# EAGLE design DMC_Tracer (EAGLE 7.6.0)
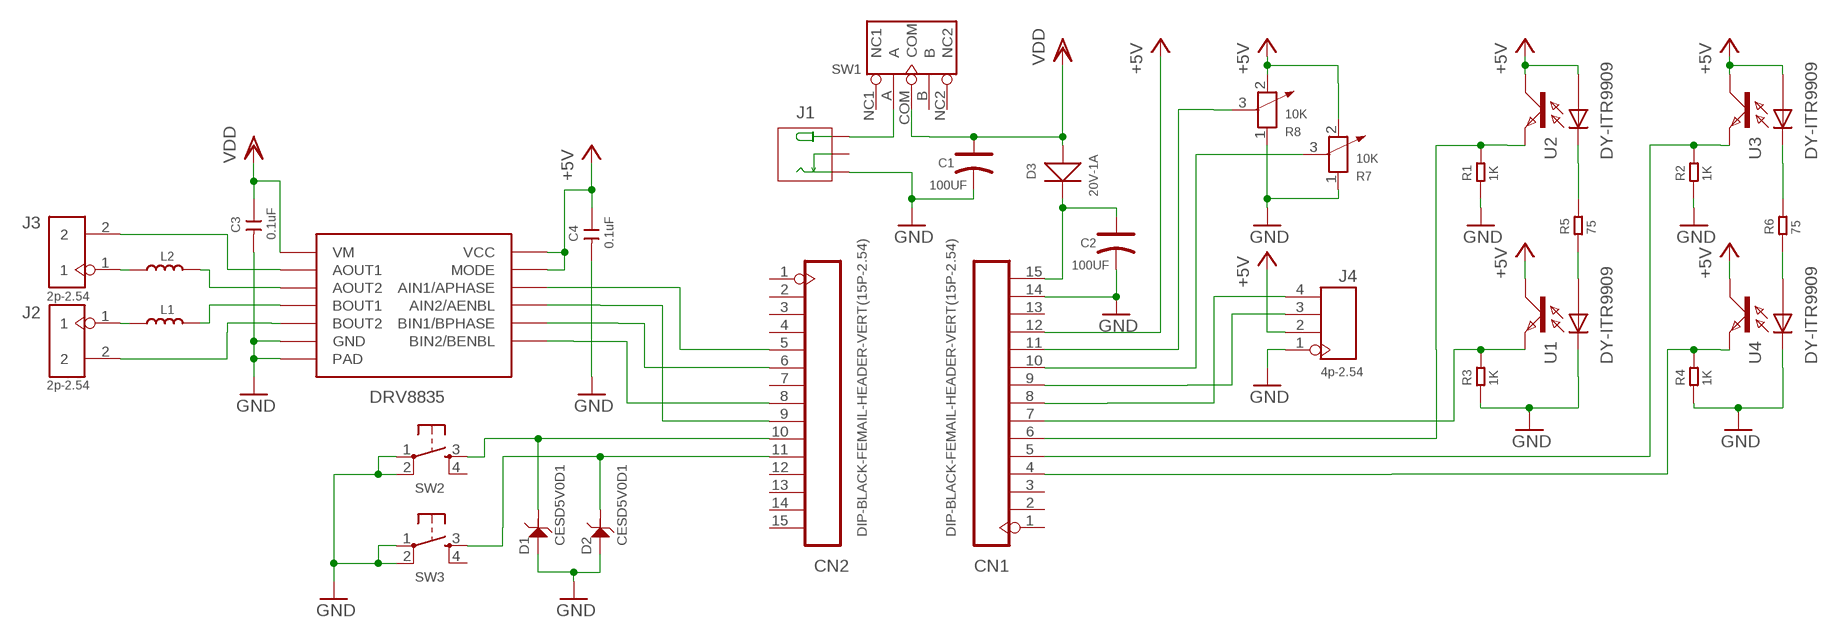
[diagram p0: schematic, sheet 1]

## Parts
C1  100UF  ALUMINUM-SMD-47UF-25V(D6.3-H5.3MM)  [ELECTRO-SMD-C-6MM]
C2  100UF  ALUMINUM-SMD-47UF-25V(D6.3-H5.3MM)  [ELECTRO-SMD-C-6MM]
C3  0.1uF  CERAMIC-100NF-50V-10%-X7R(0603)  [C0603]
C4  0.1uF  CERAMIC-100NF-50V-10%-X7R(0603)  [C0603]
CN1  DIP-BLACK-FEMAIL-HEADER-VERT(15P-2.54)  [H15-2.54]
CN2  DIP-BLACK-FEMAIL-HEADER-VERT(15P-2.54)  [H15-2.54]
D1  CESD5V0D1  SMD-DIODE-ESD-6.2V-250MW(SOD-123)  [SOD-123]
D2  CESD5V0D1  SMD-DIODE-ESD-6.2V-250MW(SOD-123)  [SOD-123]
D3  20V-1A  SMD-DIODE-SCHOTTKY-20V-1A(SOD-123)  [SOD-123]
J1  DC-005  JACK-DC-005'DC-005'  [3P-L14.2*W11.0*H9.0MM]
J2  2p-2.54  DIP-BLACK-MALE-HEADER-VERT(2P-2.54)  [H2-2.54]
J3  2p-2.54  DIP-BLACK-MALE-HEADER-VERT(2P-2.54)  [H2-2.54]
J4  4p-2.54  DIP-BLACK-FEMALE-HEADER-VERT(4P-2.54)  [H4-2.54]
L1  SMD-INDUCTOR(2P-8X8MM)  [L8040]
L2  SMD-INDUCTOR(2P-8X8MM)  [L8040]
R1  1K  SMD-RES-1K-5%-1/8W(0805)  [R0805]
R2  1K  SMD-RES-1K-5%-1/8W(0805)  [R0805]
R3  1K  SMD-RES-1K-5%-1/8W(0805)  [R0805]
R4  1K  SMD-RES-1K-5%-1/8W(0805)  [R0805]
R5  75  SMD-RES-75R-1%-1/8W(0805)  [R0805]
R6  75  SMD-RES-75R-1%-1/8W(0805)  [R0805]
R7  10K  DIP-VR-TOP-ADJ-1K-3362P(3P-7.0X7.0X5.0MM)  [ADJR3-7.0X7.0X5.0MM]
R8  10K  DIP-VR-TOP-ADJ-1K-3362P(3P-7.0X7.0X5.0MM)  [ADJR3-7.0X7.0X5.0MM]
SW1  DIP-TOGGLE-SWITCH-ON-ON(3+2P-8.8X4.6MM)-90D  [SW5-2.0-8.8X4.4X4.7MM-90D]
SW2  T-SWITCH-10-SEEED  [B3F-10XX-SEEED]
SW3  T-SWITCH-10-SEEED  [B3F-10XX-SEEED]
U1  DY-ITR9909  [DY-ITR9909]
U2  DY-ITR9909  [DY-ITR9909]
U3  DY-ITR9909  [DY-ITR9909]
U4  DY-ITR9909  [DY-ITR9909]
U$1  DRV8835  [WSON12]

## Nets
+5V: C4.1 CN1.12 J4.2 R7.2 R8.2 U1.C U2.A U2.C U3.A U3.C U4.C U$1.P$11(MODE) U$1.P$12(VCC)
AOUT1: L2.2 U$1.P$3(AOUT2)
AOUT2: J3.2 U$1.P$2(AOUT1)
BOUT1: J2.2 U$1.P$5(BOUT2)
BOUT2: L1.2 U$1.P$4(BOUT1)
GND: C1.- C2.- C3.2 C4.2 CN1.14 D1.+ D2.+ J1.-1(-) J4.1 R1.1 R2.1 R3.1 R4.1 R7.1 R8.1 SW2.1(P) SW2.2(P1) SW3.1(P) SW3.2(P1) U1.K U4.K U$1.P$6(GND) U$1.P$13(PAD) U$1.P$14(GND)
N$1: CN1.8 J4.4
N$2: CN1.9 J4.3
N$3: CN2.10 D1.- SW2.3(S)
N$4: CN2.11 D2.- SW3.3(S)
N$5: CN1.10 R7.3
N$6: CN1.6 R1.2 U2.E
N$7: CN1.5 R2.2 U3.E
N$8: CN1.4 R4.2 U4.E
N$9: R5.2 U2.K
N$10: J1.+ SW1.A
N$11: CN2.5 U$1.P$10(AIN1/APHASE)
N$12: R6.2 U3.K
N$13: J3.1 L2.1
N$14: R6.1 U4.A
N$15: R5.1 U1.A
N$16: CN2.6 U$1.P$8(BIN1/BPHASE)
N$17: CN2.9 U$1.P$9(AIN2/AENBL)
N$18: CN2.8 U$1.P$7(BIN2/BENBL)
N$19: J2.1 L1.1
N$21: C2.+ CN1.15 D3.-
N$24: CN1.11 R8.3
N$25: CN1.7 R3.2 U1.E
VDD: C1.+ C3.1 D3.+ SW1.COM U$1.P$1(VM)
Unconnected: CN1.1 CN1.2 CN1.3 CN1.13 CN2.1 CN2.2 CN2.3 CN2.4 CN2.7 CN2.12 CN2.13 CN2.14 CN2.15 J1.-2(CDN) SW1.B SW1.NC1 SW1.NC2 SW2.4(S1) SW3.4(S1)

## Library data of the parts
C1 C2 = OPL_Capacitor:ALUMINUM-SMD-47UF-25V(D6.3-H5.3MM): 302030059; MPN: CS1E470M-CRE54; VALUE: 47UF
C3 C4 = OPL_Capacitor:CERAMIC-100NF-50V-10%-X7R(0603): 302010138; MPN: CC0603KRX7R9BB104; VALUE: 100nf
CN1 CN2 = OPL_Connector:DIP-BLACK-FEMAIL-HEADER-VERT(15P-2.54)
D1 D2 = OPL_Circuit_Protection:SMD-DIODE-ESD-6.2V-250MW(SOD-123): 304060001; MPN: CESD5V0D1
D3 = OPL_Discrete_Semiconductor:SMD-DIODE-SCHOTTKY-20V-1A(SOD-123): 304020034; MPN: B5819W
J1 = OPL_Connector:JACK-DC-005: 320120003
J2 J3 = OPL_Connector:DIP-BLACK-MALE-HEADER-VERT(2P-2.54): 320020016; MPN: P125-1102A0BS116A1
J4 = OPL_Connector:DIP-BLACK-FEMALE-HEADER-VERT(4P-2.54): 320030017; MPN: F185-1104A1BSYA1
L1 L2 = OPL_Inductor:SMD-INDUCTOR(2P-8X8MM)
R1-R4 = OPL_Resistor:SMD-RES-1K-5%-1/8W(0805): 301012189; MPN: RC0805JR-071KL
R5 R6 = OPL_Resistor:SMD-RES-75R-1%-1/8W(0805): 301012181; MPN: RC0805JR-071KL; VALUE: 1K
R7 R8 = OPL_Resistor:DIP-VR-TOP-ADJ-1K-3362P(3P-7.0X7.0X5.0MM): 301040014; MPN: SX3362P; VALUE: 1K
SW1 = OPL_Switch:DIP-TOGGLE-SWITCH-ON-ON(3+2P-8.8X4.6MM)-90D: 311030008; MPN: 3P-2.0-90D3P-2.0-90D-REINFORCE
SW2 SW3 = sw2:T-SWITCH: TACTILE SWITCH
U1-U4 = Photo_Interrupter:DY-ITR9909
U$1 = Motor_Driver2:DRV8835

## Board
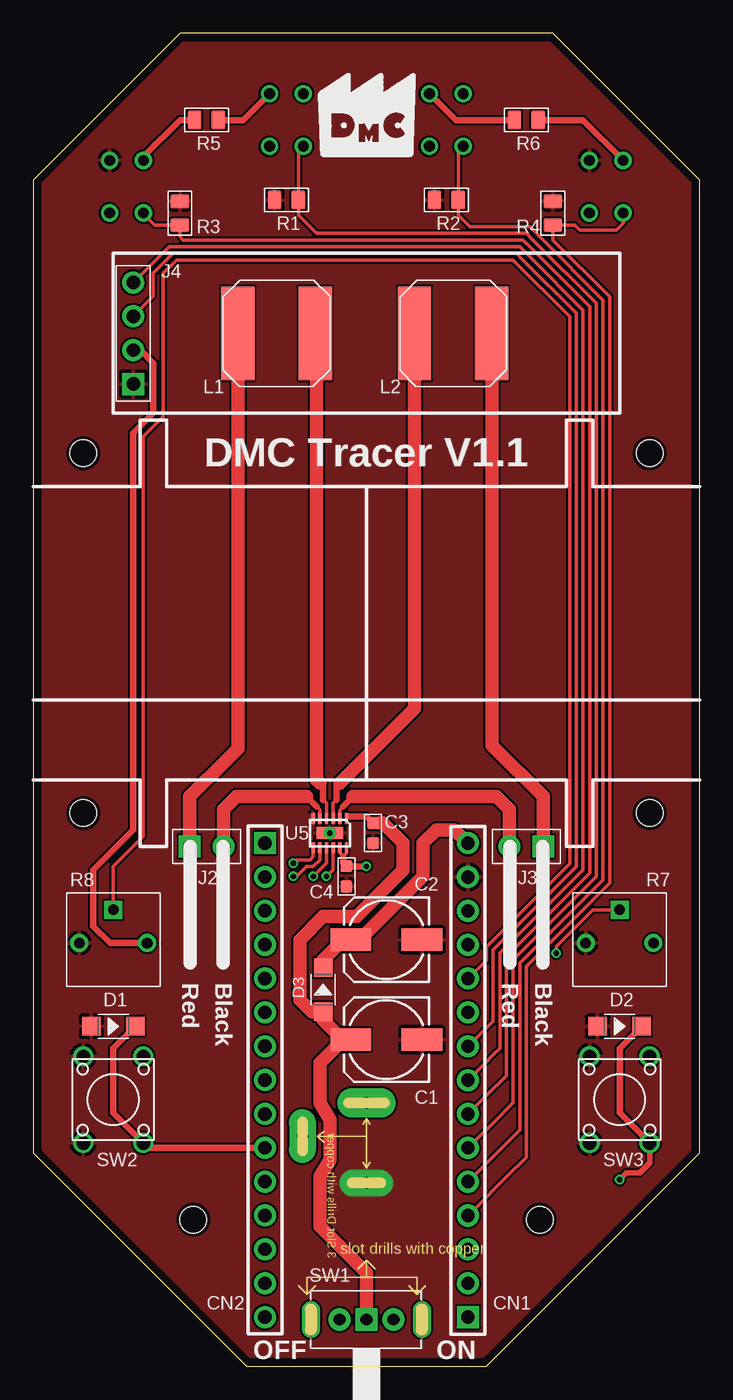
[diagram p1: board, top side]
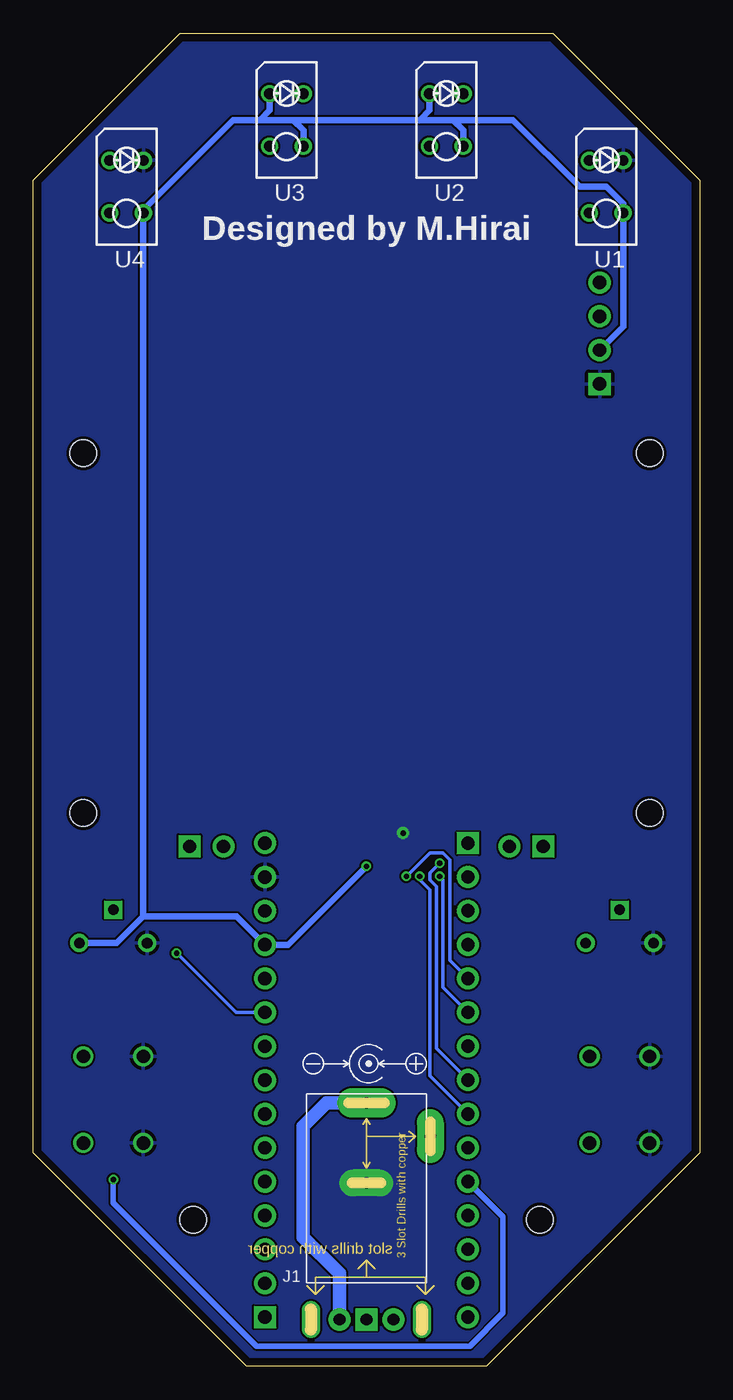
[diagram p2: board, bottom side, seen from below]

Size 50 x 100 mm. Coordinates in mm from the lower left corner, seen from the top.
Outline: 0,16 16,0 34,0 50,16 50,89 39,100 11,100 0,89 0,16
Copper layers (1*16): Top 0.035mm / dielectric 1.5mm / Bottom 0.035mm
Design rules "SeeedStudio_2layer_DRU_no_angle_20140221": minimum track width 6mil, minimum drill 12mil, track to track 6mil, track to pad 6mil, pad to pad 6mil, via to via 6mil, smd to smd 0mil, copper to edge 10mil, drill to drill 10mil, minimum pad ring 10mil, minimum via ring 6mil, stop-mask expansion 2mil, vias tented up to drill 100mil, thermal gap 10mil
Holes 2 mm at 3.75,68.5 3.75,41.5 46.25,41.5 46.25,68.5 12,11 38,11

### Footprints (pad centres in the part's own frame; a part is rotated, then mirrored left to right if it is on the bottom)
ELECTRO-SMD-C-6MM = smd 3.048 x 1.651: + 2.667,0; - -2.667,0
C0603 = smd 0.889 x 0.889: 1 0,0.762; 2 0,-0.762
H15-2.54 = drill 1 pad 1.651 square: 1 1.27,-20.32 | drill 1 pad 1.651: 2 1.27,-17.78; 3 1.27,-15.24; 4 1.27,-12.7; 5 1.27,-10.16; 6 1.27,-7.62; 7 1.27,-5.08; 8 1.27,-2.54; 9 1.27,0; 10 1.27,2.54; 11 1.27,5.08; 12 1.27,7.62; 13 1.27,10.16; 14 1.27,12.7; 15 1.27,15.24
SOD-123 = smd 1.397 x 1.397: + -1.651,0; - 1.651,0
3P-L14.2*W11.0*H9.0MM = drill 0.813 pad 2.2 long: + 13.5,0 | drill 0.813 pad 2.032 long: -1 7.5,0; -2 11,-4.8
H2-2.54 = drill 1 pad 1.651 square: 1 0,1.27 | drill 1 pad 1.651: 2 0,-1.27
H4-2.54 = drill 1 pad 1.651 square: 1 0,3.81 | drill 1 pad 1.651: 2 0,1.27; 3 0,-1.27; 4 0,-3.81
L8040 = smd 7 x 2.5: 1 0,2.9; 2 0,-2.9
R0805 = smd 1.397 x 1.016: 1 0,0.889; 2 0,-0.889
ADJR3-7.0X7.0X5.0MM = drill 0.8 pad 1.35: 1 -2.54,-0.25; 2 2.54,-0.25 | drill 0.8 pad 1.35 square: 3 0,2.25
SW5-2.0-8.8X4.4X4.7MM-90D = drill 0.889 pad 1.651: A 0,2.032; B 0,-2.032 | drill 0.889 pad 1.651 square: COM 0,0 | drill 0.762 pad 1.397 long: NC1 0,4.166; NC2 0,-4.166
B3F-10XX-SEEED = drill 1: 1 -3.25,2.25; 2 3.25,2.25; 3 -3.25,-2.25; 4 3.25,-2.25
DY-ITR9909 = drill 0.8: A -1.27,1.97; C 1.27,-1.97; E -1.27,-1.97; K 1.27,1.97
WSON12 = smd 0.8 x 0.25: P$1 -1.1,1.25; P$2 -1.1,0.75; P$3 -1.1,0.25; P$4 -1.1,-0.25; P$5 -1.1,-0.75; P$6 -1.1,-1.25; P$7 1.1,-1.25; P$8 1.1,-0.75; P$9 1.1,-0.25; P$10 1.1,0.25; P$11 1.1,0.75; P$12 1.1,1.25 | smd 0.9 x 2: P$13 0,0 | drill 0.4 pad 0.813: P$14 0,0

### Placement (x,y rotation side)
C1  26.5,24.5 180 top
C2  26.5,32 180 top
C3  25.5,40 0 top
C4  23.5,36.75 0 top
CN1  31.35,24 0 top
CN2  18.65,18.93 180 top
D1  6,25.5 0 top
D2  44,25.5 0 top
D3  21.75,28.25 90 top
J1  25,6.25 90 bottom
J2  13,39 90 top
J3  37,39 270 top
J4  7.5,77.5 180 top
L1  18.25,77.5 90 top
L2  31.5,77.5 270 top
R1  19,87.5 90 top
R2  31,87.5 90 top
R3  11,86.5 0 top
R4  39,86.5 0 top
R5  13,93.5 90 top
R6  37,93.5 270 top
R7  44,32 0 top
R8  6,32 0 top
SW1  25,3.5 270 top
SW2  6,20 90 top
SW3  44,20 90 top
U1  7,88.5 0 bottom
U2  19,93.5 0 bottom
U3  31,93.5 0 bottom
U4  43,88.5 0 bottom
U$1  22.25,40 270 top

### Tracks (layer width: path | path; a pad name or v marks a point on that pad's centre or on a via)
+5V  (via drill 0.4)
  Top 0.25: U$1.P$11 23,38.75 23,38.5 23.25,38.25 23.5,38.5 23.5,38.75 U$1.P$12
  Top 0.5: J4.2 8.04,76.23 9,75.27 9,72 9,71.75 9,71.5 7.5,70 7.5,40.25 6.75,39.5 4.5,37.25 4.5,33 5.75,31.75 R8.2 | v25,37.5 23.51,37.5 C4.1 23.25,37.76 23.25,38.25
  Bottom 0.5: U2.C 17.73,92.23 17.73,92.73 18.5,93.5 | U2.A 20.27,94.77 20.27,94.23 21,93.5 | U3.C 29.73,92.23 29.73,92.73 30.5,93.5 | U3.A 32.27,94.77 32.27,94.23 33,93.5 | U4.C 41.73,86.77 40,88.5 35,93.5 33,93.5 | 33,93.5 30.5,93.5 | 30.5,93.5 21,93.5 | 21,93.5 18.5,93.5 | 18.5,93.5 17.5,93.5 14,93.5 9,88.5 7,88.5 5.73,87.23 U1.C 5.73,79.77 5.73,78 J4.2 | 41.75,33.75 41.25,33.75 34.75,33.75 CN1.12 30.88,31.62 v25,37.5 | U4.C 41.75,86.51 | 41.75,33.75 43.75,31.75 R7.2 | 41.75,33.75 41.75,34.5 41.75,85.76 U4.C
AOUT1
  Top 0.25: U$1.P$3 22.5,42.25 22.75,42.5
  Top 0.5: 22.75,42.5 22.75,43.5 23,43.75
  Top 1: 23,43.75 28.35,49.1 28.6,49.35 L2.2
AOUT2
  Top 0.25: U$1.P$2 23,41.75 23.25,42
  Top 0.5: 23.25,42 24,42.75
  Top 1: J3.2 35.73,41.77 34.75,42.75 24,42.75
BOUT1
  Top 0.25: U$1.P$5 21.5,41.75 21.25,42
  Top 0.5: 21.25,42 20.5,42.75
  Top 1: J2.2 14.27,41.77 15.25,42.75 19.75,42.75 20.5,42.75
BOUT2
  Top 0.25: U$1.P$4 22,42.25 21.75,42.5
  Top 0.5: 21.75,42.5 21.75,43.5 21.5,43.75
  Top 1: L1.2 21.25,77.4 21.25,65.25 21.25,44 21.5,43.75
GND
  pour Bottom: 0.75,16.25 16.25,0.75 33.75,0.75 49.25,16.25 49.25,88.75 38.75,99.25 11.25,99.25 0.75,88.75
  pour Top: 0.75,16.25 16.25,0.75 33.75,0.75 49.25,16.25 49.25,88.75 38.75,99.25 11.25,99.25 0.75,88.75
  pour Top (no thermals): 20.5,41.38 21,41.38 21,40.83 20.5,40.83
  pour Bottom (no thermals): 22,40.75 21.5,40.25 21.5,39.75 22,39.25 22.5,39.25 23,39.75 23,40.25 22.5,40.75
  pour Bottom (no thermals): 23,15 22.5,14.5 22.5,13 23,12.5 27,12.5 27.5,13 27.5,14.5 27,15
  pour Top (no thermals): 23,15 22.5,14.5 22.5,13 23,12.5 27,12.5 27.5,13 27.5,14.5 27,15
N$1
  Top 0.25: J4.4 10.19,84 34.75,84 36.5,84 37,83.5 37.25,83.25 41.25,79.25 41.25,74.5 41.25,42 41.25,38.5 41.25,37.25 37.75,33.75 35,31 35,23.84 34.5,23.34 34,22.84 CN1.8
N$2
  Top 0.25: J4.3 9,80.27 9,82 10.5,83.5 12.23,83.5 36.25,83.5 36.75,83 40.75,79 40.75,74.25 40.75,42 40.75,39 40.75,37.5 37.25,34 35,31.75 34.5,31.25 34.5,29 34.5,25.88 34,25.38 CN1.9
N$3
  Top 0.5: D1.- 6,23.85 6,22.25 6,19 SW2.3 8.62,16.39 CN2.10
N$4  (via drill 0.4)
  Top 0.4: SW3.3 46.25,15.25 45.5,14.5
  Top 0.406: v44,14 44.5,14.5 45.5,14.5
  Top 0.5: D2.- 44,23.85 44,21.75 44,19 SW3.3
  Bottom 0.4: CN2.11 14.75,11.21 14.75,4 17.25,1.5 20,1.5 32.5,1.5 33.25,1.5 35.25,3.5 44,12.25 44,13
  Bottom 0.406: 44,13 v44,14
N$5  (via drill 0.4)
  Top 0.25: R7.3 42,34.25 39.25,31.5 v39.25,31
  Bottom 0.25: CN1.10 34.79,26.54 v39.25,31
N$6
  Top 0.25: R1.2 19.89,87.11 R1.2 | R1.2 19.89,91.15 U2.E | R1.2 19.89,86.36 20,86.25 21.25,85 37,85 37.5,84.5 42.25,79.75 42.25,75 42.25,42 42.25,37.5 42.25,36.75 38.75,33.25 36,30.5 36,19.76 35.5,19.26 35,18.76 CN1.6
N$7
  Top 0.25: 32,87.5 R2.2 | 31.89,87 R2.2 | R2.2 31.89,91.15 U3.E | R2.2 31.89,86.5 31.89,86.36 32.75,85.5 32.89,85.5 37.25,85.5 37.75,85 38,84.75 42.75,80 42.75,75.25 42.75,42 42.75,39 42.75,36.75 42.75,36.5 39.62,33.38 | 39.25,33 39.62,33.38 | CN1.5 35.5,16.72 36,17.22 36.5,17.72 36.5,30.25 39.62,33.38
N$8
  Top 0.25: R4.2 39.14,85.61 | R4.2 39,84.5 43.25,80.25 43.25,75.5 43.25,42 43.25,38.5 43.25,36.25 39.75,32.75 37,30 37,15.68 36.5,15.18 36,14.68 CN1.4 | U4.E 44.27,85.77 44,85.5 43.75,85.25 41,85.25 40.75,85.5 40.64,85.61 R4.2
N$9
  Top 0.5: U2.K 15.76,93.5 R5.2
N$10
  Bottom 1: SW1.A 27.03,6.97 29.75,9.69 29.75,18 28.07,19.68 28,19.75 J1.+
N$11  (via drill 0.4)
  Top 0.25: U$1.P$10 22.5,37.75 22.5,37.25 v22,36.75
  Bottom 0.25: v22,36.75 20.25,38.5 19.25,38.5 18.75,38 18.75,37.5 18.75,31.45 18.75,30.45 CN2.5
N$12
  Top 0.5: R6.2 34.5,93.5 31.7,93.5 U3.K
N$13
  Top 1: J3.1 38.27,42.73 34.5,46.5 34.4,46.6 L2.1
N$14
  Top 0.5: U4.A 41.24,93.5 R6.1
N$15
  Top 0.5: U1.A 8.27,90.77 11,93.5 R5.1
N$16  (via drill 0.4)
  Top 0.25: U$1.P$8 21.5,38.25 21.5,38 21,37.5 20.5,37.5 20.25,37.25 19.75,36.75 v19.5,36.75
  Bottom 0.25: v19.5,36.75 19.25,36.5 19.25,29.41 19.25,28.41 CN2.6
N$17  (via drill 0.4)
  Top 0.25: U$1.P$9 22,38 22,37.75 v21,36.75
  Bottom 0.25: v21,36.75 21,36.5 20.75,36.25 20.25,35.75 20.25,35.25 20.25,34.25 20.25,27.25 20.25,22.8 20.25,21.8 CN2.9
N$18  (via drill 0.4)
  Top 0.25: U$1.P$7 21,38.75 U$1.P$7 | U$1.P$7 21,38.5 21,38.25 20.75,38 19.75,38 v19.5,37.75
  Bottom 0.25: 20.25,37 v19.5,37.75 | v19.5,37.75 20.25,37 | 20.25,37 v19.5,37.75 | v19.5,37.75 20.25,37 | 20.25,37 v19.5,37.75 | 20.25,37 20.25,36.5 19.75,36 19.75,30.5 19.75,24.84 19.75,23.84 CN2.8
N$19
  Top 1: J2.1 11.73,42.73 14.5,45.5 15.35,46.35 L1.1
N$21
  Top 1: D3.- 21.75,30.5 23,31.75 23.58,31.75 C2.+ 24.08,32.25 24.75,32.25 26.5,34 29.25,36.75 29.25,39.25 30.25,40.25 31.61,40.25 CN1.15
N$24
  Top 0.25: R8.3 6,37.5 8.25,39.75 8.25,43.75 8.25,44 8.25,69.75 9.75,71.25 9.75,75.5 9.75,75.75 9.75,82 10.75,83 36,83 40.25,78.75 40.25,43.5 40.25,43.25 40.25,39.75 40.25,37.71 36.75,34.21 34,31.46 34,30.46 CN1.11
N$25
  Top 0.25: U1.E 8.27,86.45 9.11,85.61 R3.2 11,84.75 11.25,84.5 36.75,84.5 37.25,84 41.75,79.5 41.75,74.75 41.75,42 41.75,41.75 41.75,38 41.75,37 38.38,33.62 | 38.25,33.5 38.38,33.62 | CN1.7 34.5,20.8 35,21.3 35.5,21.8 35.5,30.75 38.38,33.62
VDD
  Top 0.25: 25.51,40.75 C3.1 25.99,40.76 26,40.75 | U$1.P$1 23.5,41.12 23.63,41.25
  Top 0.5: 23.63,41.25 25.01,41.25 C3.1
  Top 1: SW1.COM 25,5.25 25,7 21.5,10.5 21.5,14.25 22.25,15.5 22.25,18 22.25,18.5 21.5,19.75 21.5,22.75 22.25,23.5 23.25,24.5 | C1.+ 24.25,24.75 | 24.5,24.5 C1.+ | C1.+ 23.25,24.5 | 23.25,24.5 21.75,26 D3.+ 20.9,26.6 20.25,27.25 20,27.5 20,32 21.75,33.75 24.25,33.75 26,35.5 27.75,37.25 27.75,39.25 27.25,39.75 26.5,40.5 26.25,40.75 26,40.75 | 23.25,24.5 C1.+

### Text on the board
tPlace: DMC Tracer V1.1 | U5 | Red | Black | Red | Black | OFF | ON
bPlace: Designed by M.Hirai